# EAGLE schematic Soleful (EAGLE 7.7.0)
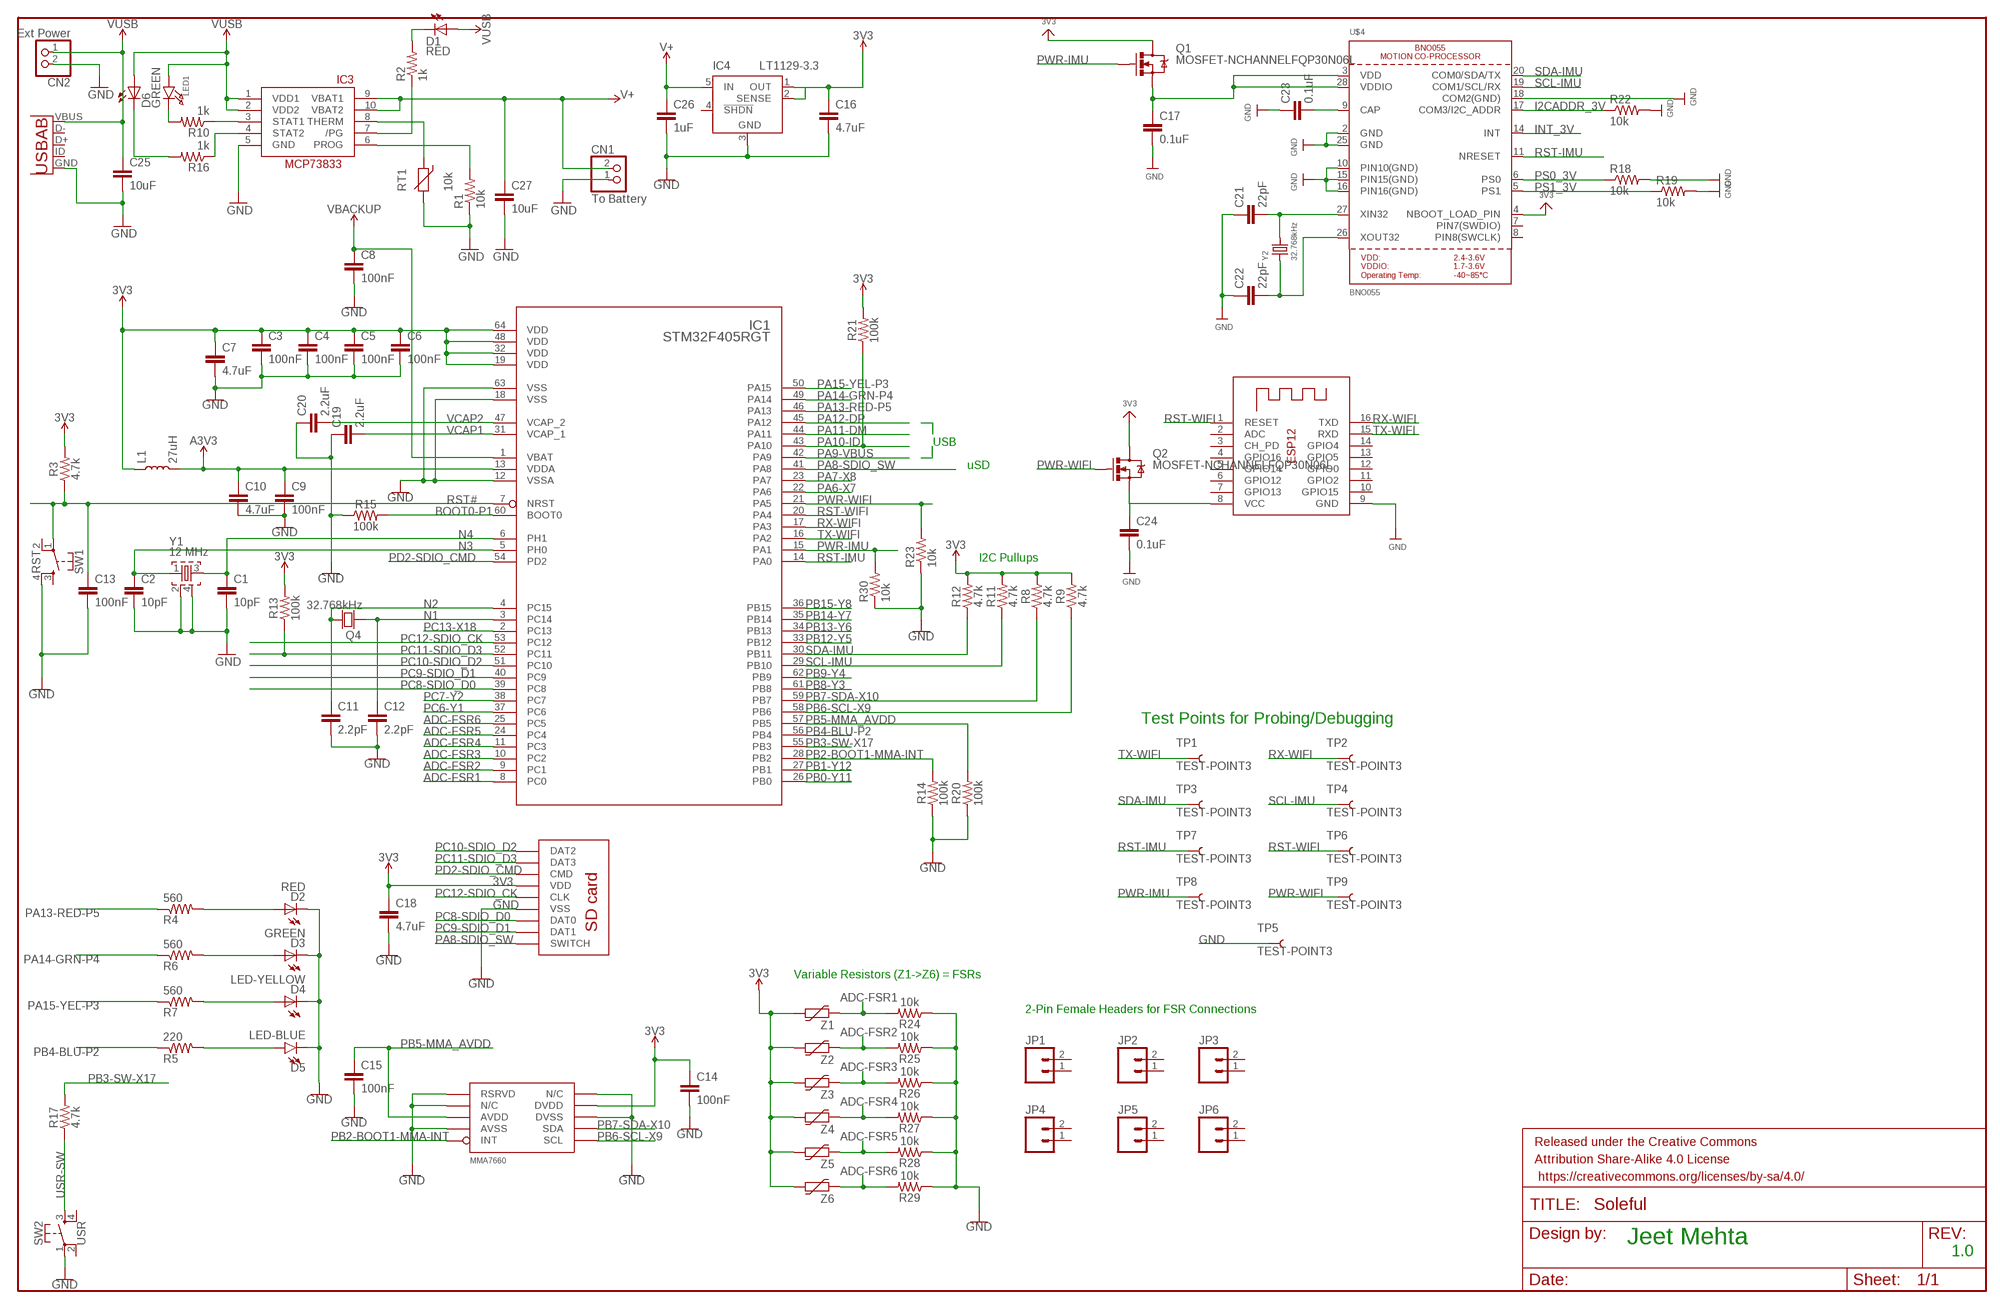
[diagram p0: schematic, sheet 1]

## Parts
C1  10pF  10PF-0603-50V-5%  [0603]
C2  10pF  10PF-0603-50V-5%  [0603]
C3  100nF  CAP0603-CAP  [0603-CAP]
C4  100nF  CAP0603-CAP  [0603-CAP]
C5  100nF  CAP0603-CAP  [0603-CAP]
C6  100nF  CAP0603-CAP  [0603-CAP]
C7  4.7uF  4.7UF0603  [0603]
C8  100nF  CAP0603-CAP  [0603-CAP]
C9  100nF  CAP0603-CAP  [0603-CAP]
C10  4.7uF  4.7UF0603  [0603]
C11  2.2pF  CAP0603-CAP  [0603-CAP]
C12  2.2pF  CAP0603-CAP  [0603-CAP]
C13  100nF  CAP0603-CAP  [0603-CAP]
C14  100nF  CAP0603-CAP  [0603-CAP]
C15  100nF  CAP0603-CAP  [0603-CAP]
C16  4.7uF  4.7UF-6.3V-10%(0603)  [0402-CAP]
C17  0.1uF  CAP0603-CAP  [0603-CAP]
C18  4.7uF  4.7UF0603  [0603]
C19  2.2uF  2.2UF-CERCAP-07888  [0402-CAP]
C20  2.2uF  2.2UF-CERCAP-07888  [0402-CAP]
C21  22pF  CAP0603-CAP  [0603-CAP]
C22  22pF  CAP0603-CAP  [0603-CAP]
C23  0.1uF  CAP0603-CAP  [0603-CAP]
C24  0.1uF  CAP0603-CAP  [0603-CAP]
C25  10uF  10UF-6.3V-20%(1206)  [1206]
C26  1uF  1UF-25V-10%(0805)  [0805]
C27  10uF  10UF-6.3V-20%(1206)  [1206]
CN1  To Battery  JST_2PIN-SMT  [JST-PH-2-SMT]
CN2  Ext Power  JST_2PIN-SMT  [JST-PH-2-SMT]
D1  RED  LED-RED0603  [LED-0603]
D2  RED  LED-RED0603  [LED-0603]
D3  GREEN  LED-GREEN0603  [LED-0603]
D4  LED-YELLOW  LED-YELLOW0603  [LED-0603]
D5  LED-BLUE  LED-BLUE0603  [LED-0603@1]
D6  GREEN  LED-GREEN0603  [LED-0603]
FRAME1  FRAME-LEDGER  [CREATIVE_COMMONS]
IC1  STM32F405RGT  [LQFP64]
IC3  MCP73833-UN  [MSOP10]
IC4  LT1129-3.3  LT1129CT-5  [TO220-5]
JP1  MODERNDEVICE_M02JST-PTH-2  [MODERNDEVICE_JST-2-PTH]
JP2  MODERNDEVICE_M02JST-PTH-2  [MODERNDEVICE_JST-2-PTH]
JP3  MODERNDEVICE_M02JST-PTH-2  [MODERNDEVICE_JST-2-PTH]
JP4  MODERNDEVICE_M02JST-PTH-2  [MODERNDEVICE_JST-2-PTH]
JP5  MODERNDEVICE_M02JST-PTH-2  [MODERNDEVICE_JST-2-PTH]
JP6  MODERNDEVICE_M02JST-PTH-2  [MODERNDEVICE_JST-2-PTH]
L1  27uH  INDUCTOR-SDR13-27UH  [INDUCTOR_SDR1307]
LED1  LED0603  [CHIPLED_0603]
Q1  MOSFET-NCHANNELFQP30N06L  [TO220V]
Q2  MOSFET-NCHANNELFQP30N06L  [TO220V]
Q4  32.768kHz  TXC-CRYSTAL32X15  [TXC-SMD-32X15]
R1  10k  10K-1%RES-00824  [0402-RES]
R2  1k  1K-1%  [0402-RES]
R3  4.7k  4.7KOHM-0603-1/10W-1%  [0603]
R4  560  RESISTOR0603-RES  [0603-RES]
R5  220  RESISTOR0603-RES  [0603-RES]
R6  560  RESISTOR0603-RES  [0603-RES]
R7  560  RESISTOR0603-RES  [0603-RES]
R8  4.7k  4.7KOHM-0603-1/10W-1%  [0603]
R9  4.7k  4.7KOHM-0603-1/10W-1%  [0603]
R10  1k  1K-1%  [0402-RES]
R11  4.7k  4.7KOHM-0603-1/10W-1%  [0603]
R12  4.7k  4.7KOHM-0603-1/10W-1%  [0603]
R13  100k  100KOHM-0603-1/10W-1%  [0603]
R14  100k  100KOHM-0603-1/10W-1%  [0603]
R15  100k  100KOHM-0603-1/10W-1%  [0603]
R16  1k  1K-1%  [0402-RES]
R17  4.7k  4.7KOHM-0603-1/10W-1%  [0603]
R18  10k  10K-1%RES-00824  [0402-RES]
R19  10k  10K-1%RES-00824  [0402-RES]
R20  100k  100KOHM-0603-1/10W-1%  [0603]
R21  100k  100KOHM-0603-1/10W-1%  [0603]
R22  10k  10K-1%RES-00824  [0402-RES]
R23  10k  10KOHM1/10W1%(0603)  [0402-RES]
R24  10k  10KOHM-0603-1/10W-1%  [0603]
R25  10k  10KOHM-0603-1/10W-1%  [0603]
R26  10k  10KOHM-0603-1/10W-1%  [0603]
R27  10k  10KOHM-0603-1/10W-1%  [0603]
R28  10k  10KOHM-0603-1/10W-1%  [0603]
R29  10k  10KOHM-0603-1/10W-1%  [0603]
R30  10k  10KOHM1/10W1%(0603)  [0402-RES]
RT1  10k  THERMISTOR-5  [R-5]
SW1  RST  MOMENTARY-SWITCH-SPST-2-SMD-4.6X2.8MM  [TACTILE_SWITCH_SMD_4.6X2.8MM]
SW2  USR  MOMENTARY-SWITCH-SPST-2-SMD-4.6X2.8MM  [TACTILE_SWITCH_SMD_4.6X2.8MM]
TP1  TEST-POINT3  [PAD.03X.03]
TP2  TEST-POINT3  [PAD.03X.03]
TP3  TEST-POINT3  [PAD.03X.03]
TP4  TEST-POINT3  [PAD.03X.03]
TP5  TEST-POINT3  [PAD.03X.03]
TP6  TEST-POINT3  [PAD.03X.03]
TP7  TEST-POINT3  [PAD.03X.03]
TP8  TEST-POINT3  [PAD.03X.03]
TP9  TEST-POINT3  [PAD.03X.03]
U1  USB Power  USB-AB  [USB-AB-MICRO-SMD]
U$1  MMA7660  [DFN10]
U$4  BNO055  [BNO055]
U$9  MOLEX-SD-105027  [MOLEX-SD-105027-PKG]
X1  ESP-12  [ESP-12]
Y1  12 MHz  FA-128  [FA-128]
Y2  32.768kHz  CRYSTAL8.0X3.8  [CRYSTAL_8X3.8]
Z1  VARISTOR-0402  [0402-RES]
Z2  VARISTOR-0402  [0402-RES]
Z3  VARISTOR-0402  [0402-RES]
Z4  VARISTOR-0402  [0402-RES]
Z5  VARISTOR-0402  [0402-RES]
Z6  VARISTOR-0402  [0402-RES]

## Nets
3V3: C3.1 C4.1 C5.1 C6.1 C7.1 C14.1 C16.1 C18.1 IC1.19(VDD) IC1.32(VDD) IC1.48(VDD) IC1.64(VDD) IC4.1(OUT) L1.P$1 Q1.2(D) Q2.2(D) R3.2 R8.2 R9.2 R11.2 R12.2 R13.2 R21.2 U$1.P$9(DVDD) U$4.4(NBOOT_LOAD_PIN) U$9.P$4(VDD) Z1.2 Z2.2 Z3.2 Z4.2 Z5.2 Z6.2
A3V3: C9.1 C10.1 IC1.13(VDDA) L1.P$2
ADC-FSR1: IC1.8(PC0) R24.2 Z1.1
ADC-FSR2: IC1.9(PC1) R25.2 Z2.1
ADC-FSR3: IC1.10(PC2) R26.2 Z3.1
ADC-FSR4: IC1.11(PC3) R27.2 Z4.1
ADC-FSR5: IC1.24(PC4) R28.2 Z5.1
ADC-FSR6: IC1.25(PC5) R29.2 Z6.1
BOOT0-P1: IC1.60(BOOT0) R15.2
GND: C1.2 C2.2 C3.2 C4.2 C5.2 C6.2 C7.2 C8.2 C9.2 C10.2 C11.2 C12.2 C13.2 C14.2 C15.2 C16.2 C17.2 C18.2 C19.1 C20.1 C21.1 C22.1 C23.1 C24.2 C25.2 C26.2 C27.2 CN1.1 CN2.2 D2.C D3.C D4.C D5.C IC1.12(VSSA) IC1.18(VSS) IC1.63(VSS) IC3.5(GND) IC4.3(GND) R1.1 R14.1 R15.1 R18.2 R19.2 R20.1 R22.2 R23.1 R24.1 R25.1 R26.1 R27.1 R28.1 R29.1 R30.1 RT1.2 SW1.4 SW2.1 TP5.P$1 U1.GND U$1.P$1(RSRVD) U$1.P$2(N/C) U$1.P$4(AVSS) U$1.P$8(DVSS) U$1.P$10(N/C) U$4.2(GND) U$4.10(PIN10(GND)) U$4.15(PIN15(GND)) U$4.16(PIN16(GND)) U$4.18(COM2(GND)) U$4.25(GND) U$9.P$6(VSS) X1.9(GND) Y1.2 Y1.4
I2CADDR_3V: R22.1 U$4.17(COM3/I2C_ADDR)
INT_3V: U$4.14(INT)
N1: C12.1 IC1.3(PC14) Q4.P$1
N2: C11.1 IC1.4(PC15) Q4.P$2
N3: C2.1 IC1.5(PH0) Y1.1
N4: C1.1 IC1.6(PH1) Y1.3
N$3: IC4.2(SENSE)
N$4: D3.A R6.2
N$5: D4.A R7.2
N$6: D5.A R5.2
N$7: D2.A R4.2
N$8: IC3.6(PROG) R1.2
N$9: IC3.7(/PG) R2.1
N$10: D1.C R2.2
N$11: IC3.8(THERM) RT1.1
N$12: IC3.3(STAT1) R10.1
N$13: IC3.4(STAT2) R16.1
N$14: D6.C R16.2
N$15: LED1.C R10.2
N$16: Q2.3(S) X1.8(VCC)
N$17: C17.1 Q1.3(S) U$4.3(VDD) U$4.28(VDDIO)
N$19: C24.1
N$55: C21.2 U$4.27(XIN32) Y2.P$4
N$56: C22.2 U$4.26(XOUT32) Y2.P$1
N$57: C23.2 U$4.9(CAP)
PA6-X7: IC1.22(PA6)
PA7-X8: IC1.23(PA7)
PA8-SDIO_SW: IC1.41(PA8) U$9.G$1(SWITCH)
PA9-VBUS: IC1.42(PA9)
PA10-ID: IC1.43(PA10) R21.1
PA11-DM: IC1.44(PA11)
PA12-DP: IC1.45(PA12)
PA13-RED-P5: IC1.46(PA13) R4.1
PA14-GRN-P4: IC1.49(PA14) R6.1
PA15-YEL-P3: IC1.50(PA15) R7.1
PB0-Y11: IC1.26(PB0)
PB1-Y12: IC1.27(PB1)
PB2-BOOT1-MMA-INT: IC1.28(PB2) R14.2 U$1.P$5(INT)
PB3-SW-X17: IC1.55(PB3) R17.2
PB4-BLU-P2: IC1.56(PB4) R5.1
PB5-MMA_AVDD: C15.1 IC1.57(PB5) R20.2 U$1.P$3(AVDD)
PB6-SCL-X9: IC1.58(PB6) R9.1 U$1.P$6(SCL)
PB7-SDA-X10: IC1.59(PB7) R8.1 U$1.P$7(SDA)
PB8-Y3: IC1.61(PB8)
PB9-Y4: IC1.62(PB9)
PB12-Y5: IC1.33(PB12)
PB13-Y6: IC1.34(PB13)
PB14-Y7: IC1.35(PB14)
PB15-Y8: IC1.36(PB15)
PC6-Y1: IC1.37(PC6)
PC7-Y2: IC1.38(PC7)
PC8-SDIO_D0: IC1.39(PC8) U$9.P$7(DAT0)
PC9-SDIO_D1: IC1.40(PC9) U$9.P$8(DAT1)
PC10-SDIO_D2: IC1.51(PC10) U$9.P$1(DAT2)
PC11-SDIO_D3: IC1.52(PC11) R13.1 U$9.P$2(DAT3)
PC12-SDIO_CK: IC1.53(PC12) U$9.P$5(CLK)
PC13-X18: IC1.2(PC13)
PD2-SDIO_CMD: IC1.54(PD2) U$9.P$3(CMD)
PS0_3V: R18.1 U$4.6(PS0)
PS1_3V: R19.1 U$4.5(PS1)
PWR-IMU: IC1.15(PA1) Q1.1(G) R30.2 TP8.P$1
PWR-WIFI: IC1.21(PA5) Q2.1(G) R23.2 TP9.P$1
RST#: C13.1 IC1.7(NRST) R3.1 SW1.1
RST-IMU: IC1.14(PA0) TP7.P$1 U$4.11(NRESET)
RST-WIFI: IC1.20(PA4) TP6.P$1 X1.1(RESET)
RX-WIFI: IC1.17(PA3) TP2.P$1 X1.16(TXD)
SCL-IMU: IC1.29(PB10) R11.1 TP4.P$1 U$4.19(COM1/SCL/RX)
SDA-IMU: IC1.30(PB11) R12.1 TP3.P$1 U$4.20(COM0/SDA/TX)
TX-WIFI: IC1.16(PA2) TP1.P$1 X1.15(RXD)
USR-SW: R17.1 SW2.3
V+: C26.1 C27.1 CN1.2 IC3.9(VBAT1) IC3.10(VBAT2) IC4.5(IN)
VBACKUP: C8.1 IC1.1(VBAT)
VCAP1: C19.2 IC1.31(VCAP_1)
VCAP2: C20.2 IC1.47(VCAP_2)
VCC: D1.A ; supply symbol labelled VUSB
VUSB: C25.1 CN2.1 D6.A IC3.1(VDD1) IC3.2(VDD2) LED1.A U1.VBUS
Unconnected: IC4.4(!SHDN) JP1.1 JP1.2 JP2.1 JP2.2 JP3.1 JP3.2 JP4.1 JP4.2 JP5.1 JP5.2 JP6.1 JP6.2 SW1.2 SW1.3 SW2.2 SW2.4 U1.D+ U1.D- U1.ID(USBID) U$4.7(PIN7(SWDIO)) U$4.8(PIN8(SWCLK)) X1.2(ADC) X1.3(CH_PD) X1.4(GPIO16) X1.5(GPIO14) X1.6(GPIO12) X1.7(GPIO13) X1.10(GPIO15) X1.11(GPIO2) X1.12(GPIO0) X1.13(GPIO5) X1.14(GPIO4)

## Notes on the sheet
- USB
- uSD
- I2C Pullups
- Test Points for Probing/Debugging
- Variable Resistors (Z1->Z6) = FSRs
- 2-Pin Female Headers for FSR Connections
- Jeet Mehta
- 1.0

## Library data of the parts
C1 C2 = SparkFun-Capacitors:10PF: 10pF ceramic capacitors A capacitor is a passive two-terminal electrical component used to store electrical energy temporarily in an electric field.; PROD_ID: CAP-11812
C3-C6 C8 C9 C11-C15 C17 C21-C24 = SparkFun-Capacitors:CAP: Capacitor Standard 0603 ceramic capacitor, and 0.1" leaded capacitor.
C7 C10 C18 = SparkFun-Capacitors:4.7UF: 4.7µF ceramic capacitors A capacitor is a passive two-terminal electrical component used to store electrical energy temporarily in an electric field.; PROD_ID: CAP-08280
C16 = SparkFun-Capacitors:4.7UF-6.3V-10%(0603): CAP-08280; PROD_ID: CAP-08280
C19 C20 = SparkFun-Retired:2.2UF-CER: 2.2uF Ceramic SMT CAP-07888- 10V, 20% (0603) CAP-10009- 50V, 10% (1206); PROD_ID: CAP-07888
C25 C27 = SparkFun-Capacitors:10UF-6.3V-20%(1206): Ceramic CAP-10057; PROD_ID: CAP-10057
C26 = SparkFun-Capacitors:1UF-25V-10%(0805): CAP-08064; PROD_ID: CAP-08064
CN1 CN2 = adafruit:JST_2PIN: JST 2-Pin Connectors of various flavors SMT-RA (S2B-PH-SM4) 4UConnector #17311 SMT (B2B-PH-SM4) THM-RA (S2B-PH) THM (B2B-PH)
D1 D2 = SparkFun-LED:LED-RED: Assorted Red LEDs LilyPad 1206- DIO-09912 1206- DIO-00809 0603- DIO-00819; PROD_ID: DIO-00819
D3 D6 = SparkFun-LED:LED-GREEN: Various green LEDs 0603- DIO-00821 LARGE- DIO-00862 LILYPAD- DIO-09910; PROD_ID: DIO-00821
D4 = SparkFun-LED:LED-YELLOW: Yellow SMD LEDs LilyPad 1206- DIO-09909 0603- DIO-09003; PROD_ID: DIO-09003
D5 = SparkFun-LED:LED-BLUE: Blue SMD LED Used in manufacturing of various products at SparkFun Packages: 0603 - SMD 0603 package [Product Link] <http://www.digikey.com/product-detail/en/SMLE12BC7TT86/511-1589-2-ND/1641808> 1206 - SMD1206 package [Product Link] <http://www.digikey.com/product-detail/en/lite-on-inc/LTST-C150TBKT/160-1643-1-ND/573584> SparkFun Products: ESP8266 Thing-Dev Board <https://www.sparkfun.com/products/13711> RedBoard <https://www.sparkfun.com/products/12757>; PROD_ID: DIO-08575; VALUE: BLUE
FRAME1 = SparkFun-Aesthetics:FRAME-LEDGER: Schematic Frame - Ledger Standard 11x14 US Ledger frame
IC1 = pyboard:STM32F405R*T: STM32F405R*T ARM Cortex-M4 32b MCU+FPU, 210DMIPS, up to 1MB Flash/192+4KB RAM, USB OTG HS/FS, 17 TIMs, 3 ADCs, 15 comm.
IC3 = adafruit:MCP73833
IC4 = linear-technology:LT1129CT-5: VOLTAGE REGULATOR with shutdown; MPN: LT1129CT-5#PBF; OC_FARNELL: 9560106; OC_NEWARK: 57M2088
JP1-JP6 = BBLeo_v2:MODERNDEVICE_M02: Header 2 Standard 2-pin 0.1" header. Use with straight break away headers (SKU : PRT-00116), right angle break away headers (PRT-00553), swiss pins (PRT-00743), machine pins (PRT-00117), and female headers (PRT-00115). Molex polarized connector foot print use with SKU : PRT-08233 with associated crimp pins and housings.
L1 = SparkFun-Coils:INDUCTOR: Inductors Resist changes in electrical current. Basically a coil of wire. SparkFun Products: SparkFun Load Cell Amplifier - HX711 <https://www.sparkfun.com/products/13879> IOIO-OTG - V2.2 <https://www.sparkfun.com/products/13613>; PROD_ID: NDUC-12529; VALUE: 27µH/±20%/3.3A
LED1 = microbuilder:LED: LED 0603 - 0603 Surface Mount Package 2mA: Green LED - Low Power (3.9mcd, 2ma, 1.7Vf) - Digikey: 475-2709-2-ND Orange LED - Low Power (9.8mcd, 2ma, 1.8Vf) - Digikey: 475-1194-2-ND Red LED - Low Power (5mcd, 2ma, 1.8Vf) - Digikey: 475-1195-2-ND Yellow LED - Low Power (7mcd, 2ma, 1.8Vf) - Digikey: 475-1196-2-ND 5mA: Blue LED - Low Power (17mcd, 5ma, 2.9Vf) - Digikey: LNJ937W8CRACT-ND 0805 - 0805 Surface Mount Package 2mA: Red LED (8.8mcd, 2mA, 1.8Vf, Clear) - Low Power [Digikey: 475-2510-1-ND] Green LED (5mcd, 2mA, 1.8Vf, Clear) - Low Power [Digikey: 475-2730-1-ND] Yellow LED (11.3mcd, 2mA, 1.8Vf, Clear) - Low Power [Digikey: 475-2555-1-ND] 20mA: Red LED (104mcd, 20mA, Diffused) - LS R976 [Digikey: 475-1278-6-ND] Red LED (12mcd, 20mA, 2.0Vf, Clear) - APT2012EC [Digikey: 754-1128-1-ND] Green LED (15mcd, 20mA, 2.2Vf, Clear) - APT2012GC [Digikey: 754-1131-1-ND] Orange LED (160mcd, 20mA, 2.1Vf, Clear) - APT2012SECK [Digikey: 754-1130-1-ND] 1206 - 1206 Surface Mount Package Green LED (26mcd, 20mA, Diffused) - LG N971 [Digikey: 475-1407-6-ND] Red LED (15mcd, 20mA, Diffused) - LH N974 [Digikey: 475-1416-6-ND]
Q1 Q2 = SparkFun-DiscreteSemi:MOSFET-NCHANNEL: Common NMOSFET Parts MFG P/N Store ID Prod ID FDD8780 TRANS-09984 SI7820DN TRANS-11055 FDS6630A IC-08089 2N7002PW TRANS-11151 FQP30N06L COM-10213 TRANS-10060 BSS123LT1G TRANS-08345 BSS138 TRANS-00830 BS170 2N7000; PROD_ID: TRANS-10060
Q4 = pyboard:TXC-CRYSTAL
R1 R18 R19 R22 = SparkFun-Resistors:10K-1%: 10k-ohm SMT 1/10W - 1% (0603) RES-00824; PROD_ID: RES-00824
R2 R10 R16 = SparkFun-Resistors:1K-1%: 1k-ohm SMT 1/10W - 1% (0603) RES-07856; PROD_ID: RES-07856
R3 R8 R9 R11 R12 R17 = SparkFun-Resistors:4.7KOHM: 4.7kΩ resistor A resistor is a passive two-terminal electrical component that implements electrical resistance as a circuit element. Resistors act to reduce current flow, and, at the same time, act to lower voltage levels within circuits. - Wikipedia; PROD_ID: RES-07857
R4-R7 = SparkFun-Resistors:RESISTOR: Resistor Basic schematic elements and footprints for 0603, 1206, and PTH resistors.
R13-R15 R20 R21 = SparkFun-Resistors:100KOHM: 100kΩ resistor A resistor is a passive two-terminal electrical component that implements electrical resistance as a circuit element. Resistors act to reduce current flow, and, at the same time, act to lower voltage levels within circuits. - Wikipedia; PROD_ID: RES-07828
R23 R30 = SparkFun-Resistors:10KOHM1/10W1%(0603): RES-00824; PROD_ID: RES-00824
R24-R29 = SparkFun-Resistors:10KOHM: 10kΩ resistor A resistor is a passive two-terminal electrical component that implements electrical resistance as a circuit element. Resistors act to reduce current flow, and, at the same time, act to lower voltage levels within circuits. - Wikipedia; PROD_ID: RES-00824
RT1 = varistor:THERMISTOR: THERMISTOR
SW1 SW2 = SparkFun-Switches:MOMENTARY-SWITCH-SPST-2: Momentary Switch (Pushbutton) - SPST - Two Circuits Normally-open (NO) SPST momentary switches (buttons, pushbuttons). Schematic symbol includes two switch circuits. Variants SMD-4.6MMX2.8MM - 4.60mm x 2.80mm Tactile Momentary Button Switch - Used on SparkFun SAMD21 Mini Breakout <https://www.sparkfun.com/products/13664> SMD-5.2MM - Mini Pushbutton Switch - SMD <https://www.sparkfun.com/products/8720> - Used on Arduino Pro Mini <https://www.sparkfun.com/products/11114>; PROD_ID: SWCH-13065
TP1-TP9 = MD-Passives:TEST-POINT: Bare copper test points for troubleshooting or ICT
U1 = SparkFun-Connectors:USB-AB: This is a USB AB connector that is compatible with USB OTG. i.e. this connector can serve as a host or device
U$1 = pyboard:MMA7660
U$4 = microbuilder:BNO055: BNO055 - Motion Co-Processor
U$9 = pyboard:MOLEX-SD-105027
X1 = adafruit:ESP-12
Y1 = crystal:FA-: MHz RANGE CRYSTAL UNIT Source: Epson Toyocom
Y2 = microbuilder:CRYSTAL: Crystals HC49UP - Surface Mount Crystal 4.0MHz 18pF +/-30ppm Surface Mount Crystal [Digikey: 535-9857-1-ND] 12.0 MHz Surface Mount Crystal [Digikey: 535-9869-6-ND] 25.0 MHz Surface Mount Crystal [Digikey: 535-9078-1-ND] 2.5 x 2.0mm - MEMs SMT Crystal 16.0 MHz 10pF 20ppm 2.5 x 2.0mm Crystal [Digikey -40-85°C: 535-10923-1-ND] 3.2 x 2.5mm - MEMs SMT Crystal 12.0 MHz 8pF 15ppm 3.2 x 2.5mm Crystal [Digikey: -10-70°C: 644-1047-1-ND -40-125°C: 644-1128-1-ND] 40~85°C cheaper: 644-1173-6-ND 16.0 MHz 8pF 15ppm 3.2 x 2.5mm Crystal [Digikey: -10-70°C: 644-1049-1-ND -40-125°C: 644-1129-2-ND]-40~85°C cheaper: 644-1175-6-ND 16.0 MHz 10pF 10ppm 3.2 x 2.5mm Crystal [Digikey: 644-1100-1-ND] 27.12 MHz 18pF 30ppm 3.2 x 2.5mm Crystal [Digikey: 887-1424-1-ND] 27.12MHz 10pF 10ppm 3.2 x 2.5mm Crystal [Digikey: 887-1329-1-ND] 4.9 x 1.8mm - MEMs SMT Crystal 32.768 KHz 12.5pF 20ppm 4.9 x 1.8mm Crystal [Digikey: SE2415CT-ND] 8.0 x 3.8mm - Surface Mount Crystal 32.768kHz 12.5pF 20ppm -40°C-85°C [Digikey: 535-9166-2-ND] Cylinder 32.768KHz Cylinder Crystal (2x6mm body) [Ex. Digikey: 300-8341-2-ND]
Z1-Z6 = SparkFun-DiscreteSemi:VARISTOR: Varistor Varistor (Variable resistor) is a nonlinear resistive element of the voltage dependence that resistance changes with applied voltage. Varistor is equivalent with Zener diode of two series connection.